# EAGLE design CR76D (EAGLE 6.5.0)
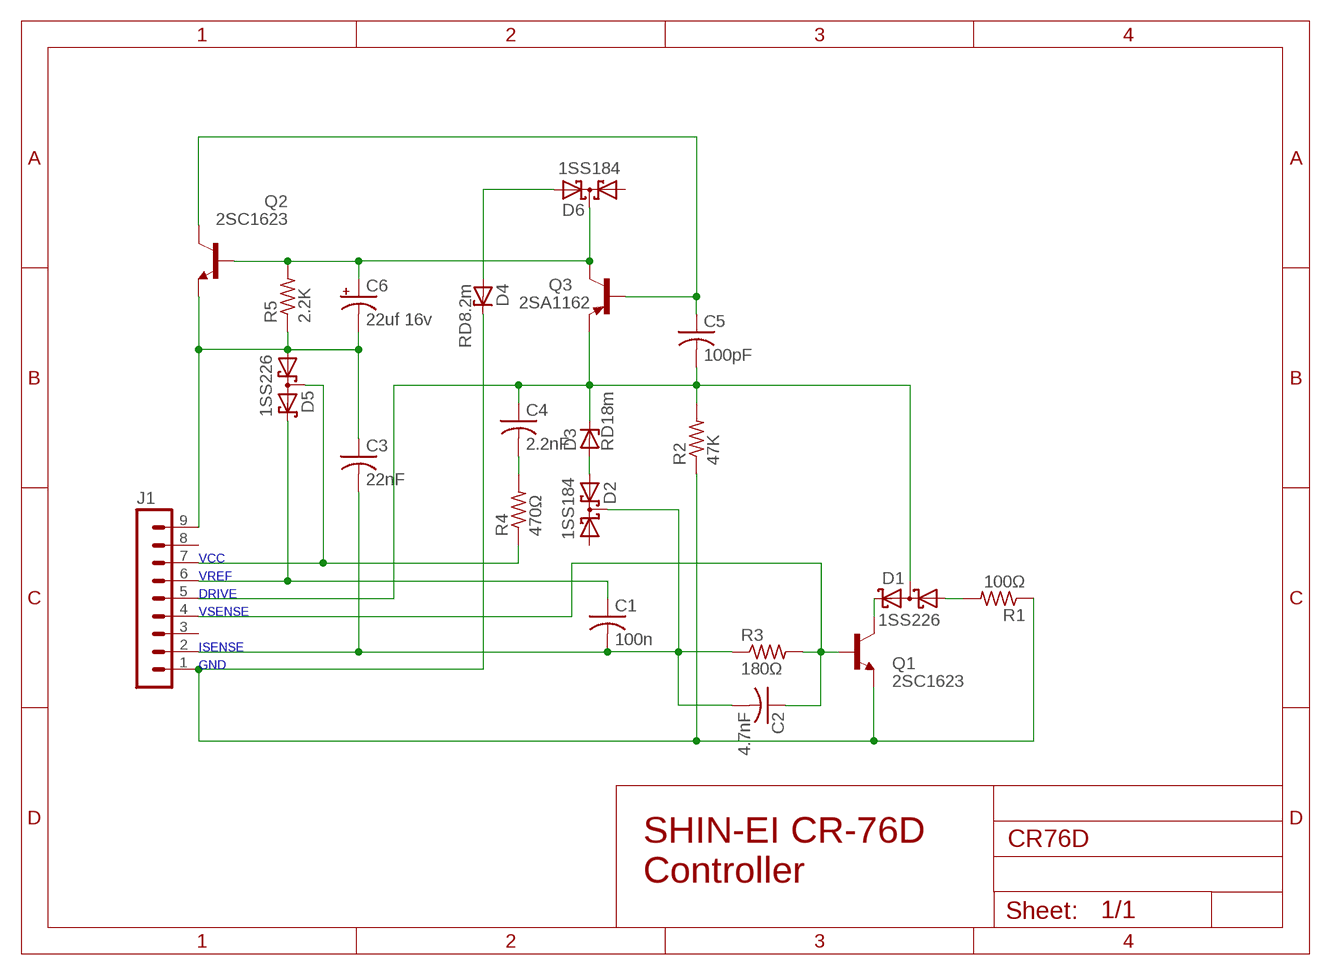
[diagram p0: schematic, sheet 1]

## Parts
C1  100n  C-USC1206  [C1206]
C2  4.7nF  C-USC0805  [C0805]
C3  22nF  C-USC0805  [C0805]
C4  2.2nF  C-USC0805  [C0805]
C5  100pF  C-USC0805  [C0805]
C6  22uf 16v  CPOL-USB/3528-21W  [B/3528-21W]
D1  1SS226  BAS40-04  [SOT23]
D2  1SS184  BAS40-05  [SOT23]
D3  RD18m  ZENER-DIODESOT23  [SOT23]
D4  RD8.2m  ZENER-DIODESOT23  [SOT23]
D5  1SS226  BAS40-04  [SOT23]
D6  1SS184  BAS40-05  [SOT23]
J1  MA09-1  [MA09-1]
Q1  2SC1623  BC849SMD  [SOT23-BEC]
Q2  2SC1623  BC849SMD  [SOT23-BEC]
Q3  2SA1162  BCX71SMD  [SOT23]
R1  100Ω  R-US_R0805W  [R0805W]
R2  47K  R-US_R0805W  [R0805W]
R3  180Ω  R-US_R0805W  [R0805W]
R4  470Ω  R-US_R0805W  [R0805W]
R5  2.2K  R-US_R0805W  [R0805W]

## Nets
DRIVE: C4.1 C5.2 D1.3(C1A2) D3.3(C) J1.5 Q3.2(E) R2.2
GND: D4.3(C) J1.1 Q1.E R1.1 R2.1
ISENSE: C1.2 C2.2 C3.2 D2.3(C) J1.2 R3.1
N$3: D2.2(A2) D3.1(A)
N$4: C4.2 R4.2
N$6: D1.2(C2) Q1.C
N$7: D1.1(A1) R1.2
N$8: C3.1 C6.- D5.1(A1) J1.9 Q2.E R5.1
N$9: C6.+ D6.3(C) Q2.B Q3.3(C) R5.2
N$10: D4.1(A) D6.2(A2)
N$11: C5.1 Q2.C Q3.1(B)
VCC: D5.3(C1A2) J1.7 R4.1
VREF: C1.1 D5.2(C2) J1.6
VSENSE: C2.1 J1.4 Q1.B R3.2
Unconnected: D2.1(A1) D6.1(A1) J1.3 J1.8

## Notes on the sheet
- SHIN-EI CR-76D
  Controller

## Library data of the parts
C1 = rcl:C-US: CAPACITOR, American symbol
C2-C5 = resistor:C-US: CAPACITOR, American symbol
C6 = resistor:CPOL-US: POLARIZED CAPACITOR, American symbol
D1 D5 = diode:BAS40-04: Silicon Schottky Diodes General-purpose diode for high-speed switching
D2 D6 = diode:BAS40-05: Silicon Schottky Diodes General-purpose diode for high-speed switching
D3 D4 = diode:ZENER-DIODE: Z-Diode
J1 = con-lstb:MA09-1: PIN HEADER; OC_FARNELL: unknown; OC_NEWARK: unknown
Q1 Q2 = transistor-npn:BC849*: NPN Transistor
Q3 = transistor-pnp:BCX71SMD: PNP Transistor
R1-R5 = resistor:R-US_: RESISTOR, American symbol

## Board
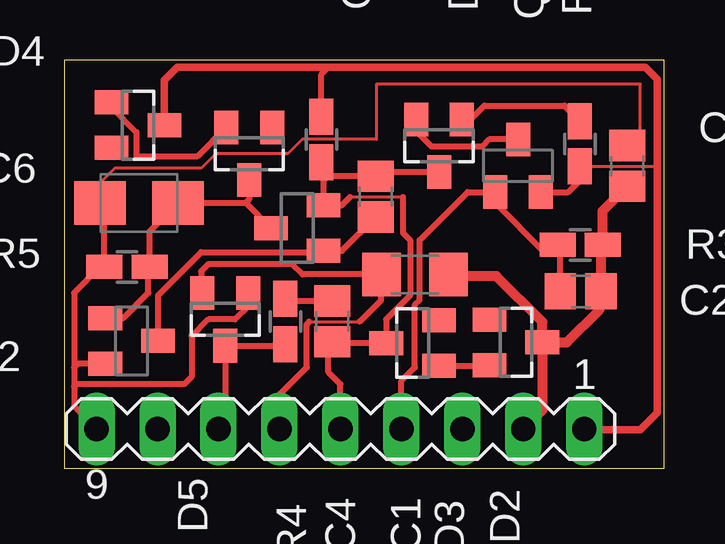
[diagram p1: board, top side]
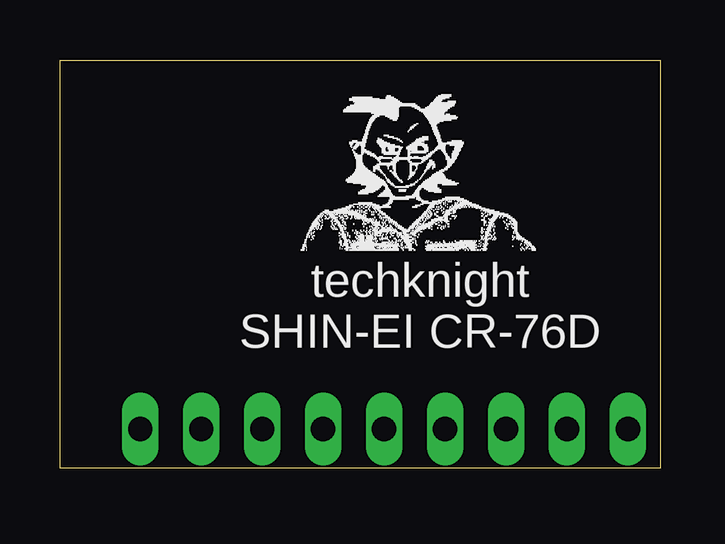
[diagram p2: board, bottom side, seen from below]

Size 25 x 17 mm. Coordinates in mm from the lower left corner, seen from the top.
Outline: 0,0 25,0 25,17 0,17 0,0
Copper layers (1*16): Top 0.035mm / dielectric 1.5mm / Bottom 0.035mm
Design rules "default": minimum track width 10mil, minimum drill 24mil, track to track 8mil, track to pad 8mil, pad to pad 8mil, via to via 8mil, smd to smd 8mil, copper to edge 40mil, drill to drill 8mil, minimum pad ring 10mil, minimum via ring 8mil, stop-mask expansion 4mil, vias tented up to drill 0mil, thermal gap 10mil

### Footprints (pad centres in the part's own frame; a part is rotated, then mirrored left to right if it is on the bottom)
C1206 = smd 1.6 x 1.8: 1 -1.4,0; 2 1.4,0
C0805 = smd 1.3 x 1.5: 1 -0.85,0; 2 0.85,0
B/3528-21W = smd 2.15 x 1.8: + 1.625,0; - -1.625,0
SOT23 = smd 1 x 1.4: 1 -0.95,-1.1; 2 0.95,-1.1; 3 0,1.1
MA09-1 = drill 1.016 long: 1 -10.16,0; 2 -7.62,0; 3 -5.08,0; 4 -2.54,0; 5 0,0; 6 2.54,0; 7 5.08,0; 8 7.62,0; 9 10.16,0
SOT23-BEC = smd 1 x 1.4: B -0.95,-1.1; C 0,1.1; E 0.95,-1.1
R0805W = smd 1.5 x 1: 1 -0.94,0; 2 0.94,0

### Placement (x,y rotation side)
C1  14.61,8.07 0 top
C2  21.51,7.36 0 top
C3  23.45,12.59 270 top
C4  11.16,6.11 90 top
C5  12.97,11.31 90 top
C6  3.11,11.05 0 top
D1  15.61,13.43 180 top
D2  18.81,5.24 270 top
D3  14.51,5.21 90 top
D4  3.07,14.29 270 top
D5  6.7,6.2 180 top
D6  7.7,13.1 180 top
J1  11.5,1.63 180 top
Q1  18.9,12.6 0 top
Q2  2.8,5.3 270 top
Q3  9.7,10 90 top
R1  21.48,13.51 90 top
R2  10.71,13.69 270 top
R3  21.49,9.3 180 top
R4  9.21,6.11 90 top
R5  2.61,8.38 0 top
U$1  [LOGO]  15,9 0 bottom

### Tracks (layer width: path | path; a pad name or v marks a point on that pad's centre or on a via)
DRIVE
  Top 0.127: 11.9,11.3 14.1,11.3
  Top 0.254: D1.3 13.14,12.33 C5.2 10.96,12.16 10.8,12 | 10.8,12 Q3.2 11.55,10.95 11.9,11.3 | 10.8,12 10.8,12.66 R2.2 | J1.5 11.5,3.5 11,4 11,5.1 C4.1 11.21,5.21 D3.3 13.4,6.2 14.4,7.2 14.4,9.5 14.1,9.8 14.1,11.3
GND
  Top 0.127: 21.57,12.57 24.63,12.57 24.7,12.5
  Top 0.254: Q1.E 21,11.5 21.5,12 21.5,12.55 R1.1 21.57,12.57 | R2.1 10.71,16.41 11,16.7
  Top 0.305: D4.3 4.17,16.17 4.7,16.7 11,16.7 24.2,16.7 24.7,16.2 24.7,12.5 24.7,2.3 24,1.6 21.69,1.6 J1.1
ISENSE
  Top 0.406: D2.3 19.91,2.42 J1.2 | D2.3 20.94,5.24 22.3,6.6 22.3,7.3 C2.2 22.36,9.23 R3.1 22.43,10.72 C3.2 | D2.3 19.91,6.09 18,8 16.03,8 C1.2
N$3
  Top 0.254: D3.1 17.68,4.26 D2.2
N$4
  Top 0.254: C4.2 9.3,6.96 R4.2
N$6
  Top 0.254: Q1.C 17.7,13.7 17.4,13.4 15.3,13.4 14.8,13.9 14.8,14.39 D1.2
N$7
  Top 0.254: D1.1 16.93,14.53 17.5,15.1 20.83,15.1 R1.2
N$8
  Top 0.127: C3.1 24,13.44 24,16 13,16 13,13.7 9.9,13.7 9.3,13.1 6.3,13.1 5.7,12.5 2.1,12.5 1.5,11.9 1.5,11.06 C6.-
  Top 0.254: C6.- 1.67,10.87 R5.1 1.48,8.38 0.4,7.3 0.4,4.2 | 0.4,4.2 0.4,3.4 | 0.4,3.4 0.4,2.57 J1.9 | Q2.E 0.55,4.35 0.4,4.2 | D5.1 7.65,6.75 7.1,6.2 6,6.2 5.3,5.5 5.3,3.8 5,3.5 0.5,3.5 0.4,3.4
N$9
  Top 0.254: 7.55,11.05 C6.+ 3.55,9.87 R5.2 3.5,8.33 3.5,7.3 2.45,6.25 Q2.B | 7.55,11.05 Q3.3 | D6.3 7.7,11.2 7.55,11.05
N$10
  Top 0.254: D4.1 1.97,15.03 3,14 3,13 5.55,13 D6.2
N$11
  Top 0.254: C5.1 11.56,9.05 Q3.1 10.75,9 5.7,9 3.9,7.2 Q2.C
VCC
  Top 0.254: R4.1 9.14,5.1 D5.3 6.7,1.91 J1.7
VREF
  Top 0.127: 10.2,6.1 12.3,6.1
  Top 0.254: C1.1 9.93,8.07 9.5,8.5 6,8.5 5.7,8.2 5.7,7.35 D5.2 | 10.2,6.1 10.1,6 10.1,4.2 8.96,3.06 J1.6 | 12.3,6.1 13.2,7 13.2,7.56 C1.1 | 13.2,8.01 C1.1
VSENSE
  Top 0.254: C2.1 20.66,9.19 R3.2 20.25,9 20,9 17.95,11.05 Q1.B 16.8,11.5 14.8,9.5 14.8,7 14.6,6.8 14.6,4.2 14.04,3.64 J1.4

### Text on the board
bPlace: techknight / SHIN-EI CR-76D